# Altium schematic sheet [05] - USB HUB CONTROLLER.SchDoc
size A4; SheetNumber: 6; SheetTotal: 10
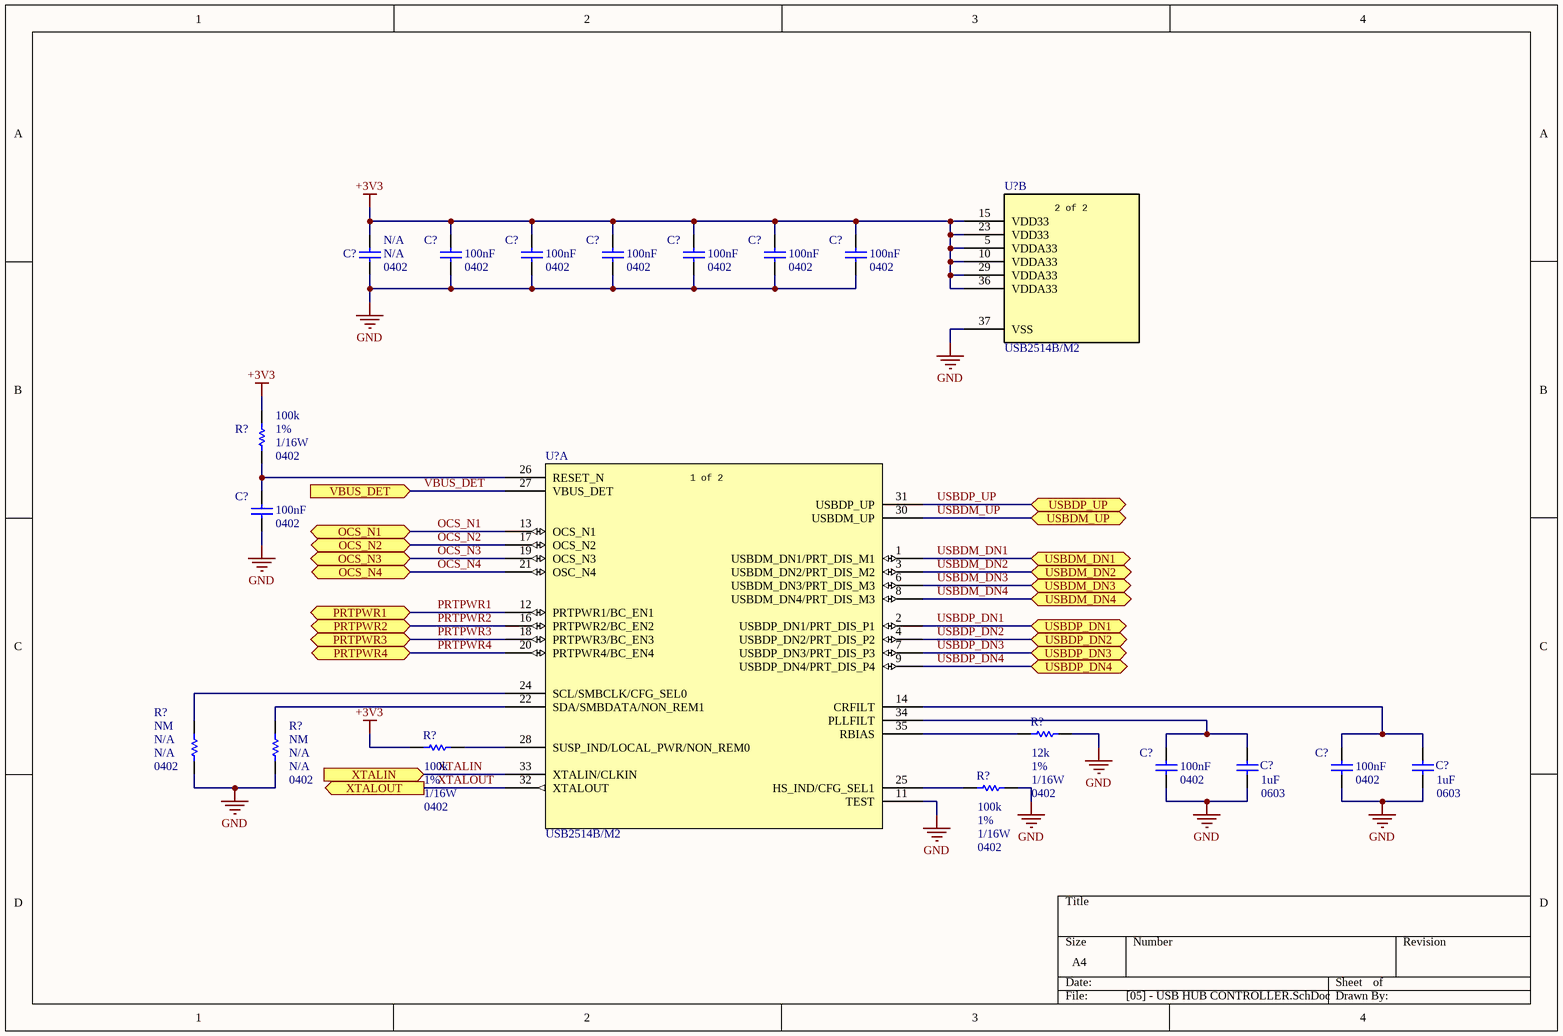
[diagram p0: [05] - USB HUB CONTROLLER.SchDoc]

## Parts
(Parts that share a designator on the sheet are numbered #1, #2 ... from top to bottom, then left to right.)
C?#1  Package / Case: 0402  [CAP_0402]  (hidden comment: CAP 0402)
C?#2  Package / Case: 0402  Capacitance: 100nF  [CAP_0402]  (hidden comment: CAP 0402)
C?#3  Package / Case: 0402  Capacitance: 100nF  [CAP_0402]  (hidden comment: CAP 0402)
C?#4  Package / Case: 0402  Capacitance: 100nF  [CAP_0402]  (hidden comment: CAP 0402)
C?#5  Package / Case: 0402  Capacitance: 100nF  [CAP_0402]  (hidden comment: CAP 0402)
C?#6  Package / Case: 0402  Capacitance: 100nF  [CAP_0402]  (hidden comment: CAP 0402)
C?#7  Package / Case: 0402  Capacitance: 100nF  [CAP_0402]  (hidden comment: CAP 0402)
C?#8  Package / Case: 0402  Capacitance: 100nF  [CAP_0402]  (hidden comment: CAP 0402)
C?#9  Package / Case: 0603  Capacitance: 1uF  [CAP_0603]  (hidden comment: CAP_0603)
C?#10  Package / Case: 0603  Capacitance: 1uF  [CAP_0603]  (hidden comment: CAP_0603)
C?#11  Package / Case: 0402  Capacitance: 100nF  [CAP_0402]  (hidden comment: CAP 0402)
C?#12  Package / Case: 0402  Capacitance: 100nF  [CAP_0402]  (hidden comment: CAP 0402)
R?#1  Tolerance: 1%  Rated Power: 1/16W  Package / Case: 0402  Resistance: 100k  [RES_0402]  (hidden comment: RES 0402)
R?#2  Tolerance: 1%  Rated Power: 1/16W  Package / Case: 0402  Resistance: 12k  [RES_0402]  (hidden comment: RES 0402)
R?#3  Tolerance: 1%  Rated Power: 1/16W  Package / Case: 0402  Resistance: 100k  [RES_0402]  (hidden comment: RES 0402)
R?#4  Package / Case: 0402  Resistance: NM  [RES_0402]  (hidden comment: RES 0402)
R?#5  Package / Case: 0402  Resistance: NM  [RES_0402]  (hidden comment: RES 0402)
R?#6  Tolerance: 1%  Rated Power: 1/16W  Package / Case: 0402  Resistance: 100k  [RES_0402]  (hidden comment: RES 0402)
U?#1  USB2514B/M2  [MC_MCU_USB2514BM2]  (part B of 2)
U?#2  USB2514B/M2  [MC_MCU_USB2514BM2]  (part A of 2)

## Ports
OCS_N1 (bidir), OCS_N2 (bidir), OCS_N3 (bidir), OCS_N4 (bidir), PRTPWR1 (bidir), PRTPWR2 (bidir), PRTPWR3 (bidir), PRTPWR4 (bidir), USBDM_DN1 (bidir), USBDM_DN2 (bidir), USBDM_DN3 (bidir), USBDM_DN4 (bidir), USBDM_UP (bidir), USBDP_DN1 (bidir), USBDP_DN2 (bidir), USBDP_DN3 (bidir), USBDP_DN4 (bidir), USBDP_UP (bidir), VBUS_DET (in), XTALIN (in), XTALOUT (out)

## Nets
+3V3: C?#1.2 C?#2.2 C?#3.2 C?#4.2 C?#5.2 C?#6.2 C?#7.2 R?#1.2 R?#3.2 U?#1.5(VDDA33) U?#1.10(VDDA33) U?#1.15(VDD33) U?#1.23(VDD33) U?#1.29(VDDA33) U?#1.36(VDDA33)
GND: C?#1.1 C?#2.1 C?#3.1 C?#4.1 C?#5.1 C?#6.1 C?#7.1 C?#8.1 C?#9.2 C?#10.2 C?#11.1 C?#12.1 R?#2.1 R?#4.1 R?#5.1 R?#6.1 U?#1.37(VSS) U?#2.11(TEST)
OCS_N1: U?#2.13(OCS_N1) ; port OCS_N1
OCS_N2: U?#2.17(OCS_N2) ; port OCS_N2
OCS_N3: U?#2.19(OCS_N3) ; port OCS_N3
OCS_N4: U?#2.21(OSC_N4) ; port OCS_N4
PRTPWR1: U?#2.12(PRTPWR1/BC_EN1) ; port PRTPWR1
PRTPWR2: U?#2.16(PRTPWR2/BC_EN2) ; port PRTPWR2
PRTPWR3: U?#2.18(PRTPWR3/BC_EN3) ; port PRTPWR3
PRTPWR4: U?#2.20(PRTPWR4/BC_EN4) ; port PRTPWR4
USBDM_DN1: U?#2.1(USBDM_DN1/PRT_DIS_M1) ; port USBDM_DN1
USBDM_DN2: U?#2.3(USBDM_DN2/PRT_DIS_M2) ; port USBDM_DN2
USBDM_DN3: U?#2.6(USBDM_DN3/PRT_DIS_M3) ; port USBDM_DN3
USBDM_DN4: U?#2.8(USBDM_DN4/PRT_DIS_M3) ; port USBDM_DN4
USBDM_UP: U?#2.30(USBDM_UP) ; port USBDM_UP
USBDP_DN1: U?#2.2(USBDP_DN1/PRT_DIS_P1) ; port USBDP_DN1
USBDP_DN2: U?#2.4(USBDP_DN2/PRT_DIS_P2) ; port USBDP_DN2
USBDP_DN3: U?#2.7(USBDP_DN3/PRT_DIS_P3) ; port USBDP_DN3
USBDP_DN4: U?#2.9(USBDP_DN4/PRT_DIS_P4) ; port USBDP_DN4
USBDP_UP: U?#2.31(USBDP_UP) ; port USBDP_UP
VBUS_DET: U?#2.27(VBUS_DET) ; port VBUS_DET
XTALIN: U?#2.33(XTALIN/CLKIN) ; port XTALIN
XTALOUT: U?#2.32(XTALOUT) ; port XTALOUT
NetC?#8_2: C?#8.2 R?#1.1 U?#2.26(RESET_N)
NetC?#9_1: C?#9.1 C?#11.2 U?#2.34(PLLFILT)
NetC?#10_1: C?#10.1 C?#12.2 U?#2.14(CRFILT)
NetR?#2_2: R?#2.2 U?#2.35(RBIAS)
NetR?#3_1: R?#3.1 U?#2.28(SUSP_IND/LOCAL_PWR/NON_REM0)
NetR?#4_2: R?#4.2 U?#2.24(SCL/SMBCLK/CFG_SEL0)
NetR?#5_2: R?#5.2 U?#2.22(SDA/SMBDATA/NON_REM1)
NetR?#6_2: R?#6.2 U?#2.25(HS_IND/CFG_SEL1)

## Notes on the sheet
- (in symbol IC_USB2514BM2, part A) 1 of 2
- (in symbol IC_USB2514BM2, part B) 2 of 2

## Library data of the parts
C?#1 = CAP_0402_NM: CAP, size 0402, NM, N/A; Supplier URL: N/A; Tolerance: N/A; Supplier: N/A; Supplier Part Number: N/A; ComponentLink1Description: Datasheet; ComponentLink1URL: N/A; Mount: SMD/SMT; Operating Temperature Max: + 85 C; Operating Temperature Min: - 40 C; Packaging: Tape and Reel; Voltage Rating DC: N/A; Capacitance: N/A
C?#2-C?#8 C?#11 C?#12 = CAP_0402_NM: CAP, size 0402, NM, N/A; Tolerance: 10%; Voltage Rating DC: 50V; Supplier URL: https://www.thegioiic.com/tu-gom-0402-100nf-0-1uf-50v; Supplier: thegioiic; Supplier Part Number: Tụ Gốm 0402 100nF (0.1uF) 50V; ComponentLink1Description: Datasheet; ComponentLink1URL: N/A; Mount: SMD/SMT; Operating Temperature Max: + 85 C; Operating Temperature Min: - 40 C; Packaging: Tape and Reel
C?#9 C?#10 = CAP_0603_NM: CAP, size 0603, NM, N/A; Tolerance: 10%; Voltage Rating DC: 50V; Packaging: Tape and Reel; Supplier URL: https://www.thegioiic.com/tu-gom-0603-1uf-50v; Supplier: thegioiic; Supplier Part Number: Tụ Gốm 0603 1uF 50V; ComponentLink1Description: Datasheet; ComponentLink1URL: N/A; Mount: SMD/SMT; Operating Temperature Max: + 85 C; Operating Temperature Min: - 40 C
R?#1-R?#3 R?#6 = RES_0402_NM: RES, size 0402, NM, N/A; Manufacturer: OEM; Supplier backup URL: N/A; Packaging: Tape and Reel; Supplier backup: N/A; Supplier backup Part Number: N/A; Manufacturer Part Number: N/A; ComponentLink1Description: Datasheet; ComponentLink1URL: N/A; Mount: SMD/SMT; Operating Temperature Max: + 85 C; Operating Temperature Min: - 40 C
  R?#1 R?#3 R?#6: Supplier: thegioiic; Supplier Part Number: Điện Trở 100 KOhm 0402 1%; Supplier URL: https://www.thegioiic.com/dien-tro-100-kohm-0402-1-
  R?#2: Supplier: CXT; Supplier Part Number: C020903; Supplier URL: https://linhkien.cxtvn.com/4697-dien-tro-0402-1-thong-so-tu-1k-den-91k.html
R?#4 R?#5 = RES_0402_NM: RES, size 0402, NM, N/A; Supplier backup URL: N/A; Packaging: Tape and Reel; Supplier: N/A; Supplier Part Number: N/A; Supplier backup: N/A; Supplier backup Part Number: N/A; Manufacturer: N/A; Manufacturer Part Number: N/A; ComponentLink1Description: Datasheet; ComponentLink1URL: N/A; Mount: SMD/SMT; Operating Temperature Max: + 85 C; Operating Temperature Min: - 40 C; LCSC Part #: N/A; Supplier URL: N/A; Tolerance: N/A; Rated Power: N/A
U?#1 U?#2 = IC_USB2514BM2: Description; Manufacturer_Name: Microchip; Copyright: Copyright (C) 2025 Ultra Librarian. All rights reserved.; Manufacturer_Part_Number: USB2514B/M2; RefDes: RefDes; Type: Type